# EAGLE design AVR_ISP_Pegelwandler (EAGLE 9.2.2)
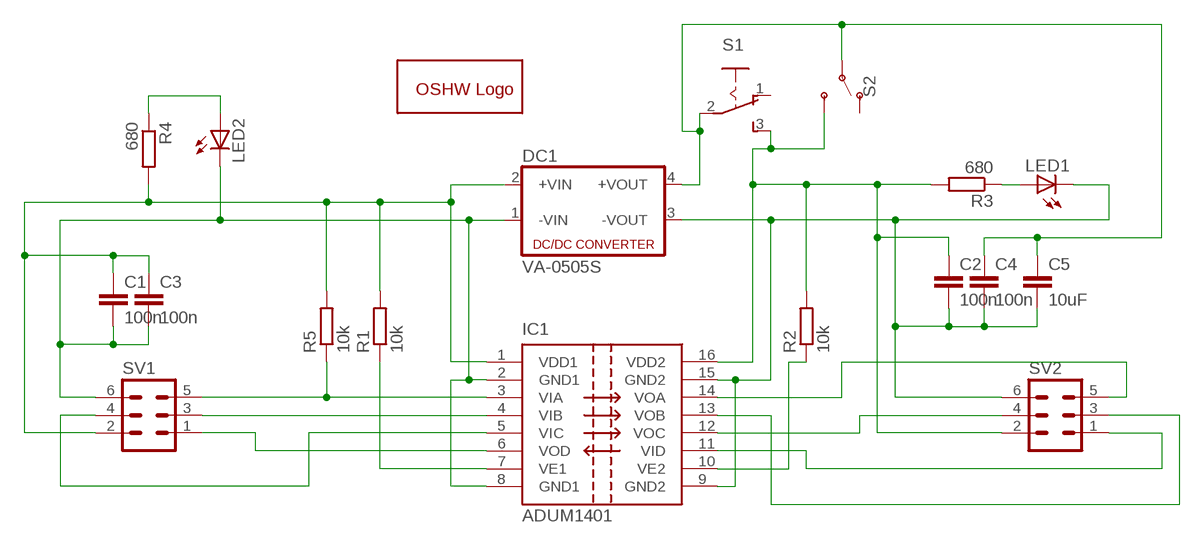
[diagram p0: schematic, sheet 1]

## Parts
C1  100n  C-EUC1206  [C1206]
C2  100n  C-EUC1206  [C1206]
C3  100n  C-EUC1206  [C1206]
C4  100n  C-EUC1206  [C1206]
C5  10uF  C-EUC1206  [C1206]
DC1  VA-0505S  [4SIL]
GOLD_ORB_SM1  OSHWLOGOLOGO5MM  [OSHW_5MM]
IC1  ADUM1401  [SO16W]
LED1  LEDCHIPLED_1206  [CHIPLED_1206]
LED2  LEDCHIPLED_1206  [CHIPLED_1206]
R1  10k  R-EU_R1206  [R1206]
R2  10k  R-EU_R1206  [R1206]
R3  680  R-EU_R1206  [R1206]
R4  680  R-EU_R1206  [R1206]
R5  10k  R-EU_R1206  [R1206]
S1  255SB  [255SB]
S2  SWITCH-SPDT-PTH-11.6X4.0MM  [SWITCH_SPDT_PTH_11.6X4.0MM]
SV1  ML6  [ML6]
SV2  ML6  [ML6]

## Nets
GND1@2: C1.2 C3.2 DC1.1(-VIN) IC1.2(GND1) IC1.8(GND1) LED2.C SV1.6
GND2@2: C2.2 C4.2 C5.2 DC1.3(-VOUT) IC1.9(GND2) IC1.15(GND2) LED1.C SV2.6
N$1: C1.1 C3.1 DC1.2(+VIN) IC1.1(VDD1) R1.2 R4.2 R5.2 SV1.2
N$2: C2.1 IC1.16(VDD2) R2.2 R3.2 S1.3(S) S2.3(S) SV2.2
N$3: LED1.A R3.1
N$4: IC1.4(VIB) SV1.3
N$5: IC1.13(VOB) SV2.3
N$6: IC1.14(VOA) SV2.5
N$7: IC1.11(VID) SV2.1
N$8: IC1.6(VOD) SV1.1
N$9: IC1.12(VOC) SV2.4
N$10: IC1.5(VIC) SV1.4
N$11: IC1.3(VIA) R5.1 SV1.5
N$12: IC1.7(VE1) R1.1
N$13: IC1.10(VE2) R2.1
N$14: C4.1 C5.1 DC1.4(+VOUT) S1.2(P) S2.2(P)
N$15: LED2.A R4.1
Unconnected: S1.1(O) S2.1(O)

## Library data of the parts
C1-C5 = resistor:C-EU: CAPACITOR, European symbol
DC1 = dc-dc-converter:VA-*?: DC DC Converter Single Output, 1 Watt Motien Technology Co.,Ltd. Source: va-serie.pdf
GOLD_ORB_SM1 = oshw:OSHWLOGO: The OSHW logo for PCB layout
IC1 = adum140x:ADUM1401
LED1 LED2 = led:LED: LED OSRAM: - CHIPLED LG R971, LG N971, LY N971, LG Q971, LY Q971, LO R971, LY R971 LH N974, LH R974 LS Q976, LO Q976, LY Q976 LO Q996 - Hyper CHIPLED LW Q18S LB Q993, LB Q99A, LB R99A - SideLED LS A670, LO A670, LY A670, LG A670, LP A670 LB A673, LV A673, LT A673, LW A673 LH A674 LY A675 LS A676, LA A676, LO A676, LY A676, LW A676 LS A679, LY A679, LG A679 - Hyper Micro SIDELED® LS Y876, LA Y876, LO Y876, LY Y876 LT Y87S - SmartLED LW L88C, LW L88S LB L89C, LB L89S, LG L890 LS L89K, LO L89K, LY L89K LS L896, LA L896, LO L896, LY L896 - TOPLED LS T670, LO T670, LY T670, LG T670, LP T670 LSG T670, LSP T670, LSY T670, LOP T670, LYG T670 LG T671, LOG T671, LSG T671 LB T673, LV T673, LT T673, LW T673 LH T674 LS T676, LA T676, LO T676, LY T676, LB T676, LH T676, LSB T676, LW T676 LB T67C, LV T67C, LT T67C, LS T67K, LO T67K, LY T67K, LW E67C LS E67B, LA E67B, LO E67B, LY E67B, LB E67C, LV E67C, LT E67C LW T67C LS T679, LY T679, LG T679 LS T770, LO T770, LY T770, LG T770, LP T770 LB T773, LV T773, LT T773, LW T773 LH T774 LS E675, LA E675, LY E675, LS T675 LS T776, LA T776, LO T776, LY T776, LB T776 LHGB T686 LT T68C, LB T68C - Hyper Mini TOPLED® LB M676 - Mini TOPLED Santana® LG M470 LS M47K, LO M47K, LY M47K Source: http://www.osram.convergy.de LUXEON: - LUMILED® LXK2-PW12-R00, LXK2-PW12-S00, LXK2-PW14-U00, LXK2-PW14-V00 LXK2-PM12-R00, LXK2-PM12-S00, LXK2-PM14-U00 LXK2-PE12-Q00, LXK2-PE12-R00, LXK2-PE12-S00, LXK2-PE14-T00, LXK2-PE14-U00 LXK2-PB12-K00, LXK2-PB12-L00, LXK2-PB12-M00, LXK2-PB14-N00, LXK2-PB14-P00, LXK2-PB14-Q00 LXK2-PR12-L00, LXK2-PR12-M00, LXK2-PR14-Q00, LXK2-PR14-R00 LXK2-PD12-Q00, LXK2-PD12-R00, LXK2-PD12-S00 LXK2-PH12-R00, LXK2-PH12-S00 LXK2-PL12-P00, LXK2-PL12-Q00, LXK2-PL12-R00 Source: www.luxeon.com KINGBRIGHT: KA-3528ASYC Source: www.kingbright.com
R1-R5 = resistor:R-EU_: RESISTOR, European symbol
S1 = switch:255SB: SLIDING SWITCH Distributor Buerklin, 11G810
S2 = SparkFun-Switches:SWITCH-SPDT: Single Pole, Double Throw (SPDT) Switch Single-pole, double-throw (SPDT) switch. Variant Overview SMD-AYZ0202 Surface Mount DPDT Switch <https://www.sparkfun.com/products/597> (COM-00597) Used on e.g. LilyPad Arduino USB - ATmega32U4 Board <https://www.sparkfun.com/products/12049> PTH-11.6X4.0MM SPDT Mini Power Switch <https://www.sparkfun.com/products/102> (COM-00102) Used on e.g. SparkFun Simon Says - Through-Hole Soldering Kit <https://www.sparkfun.com/products/10547> (KIT-10547) PTH-11.6X4.0MM-KIT KIT version of SPDT Mini Power Switch - Simplifies soldering by removing tStop of switch pins - only one side can be soldered. PTH-11.6X4.0MM-LOCK LOCK version of SPDT Mini Power Switch - Offset pins hold switch in place for easier soldering. SMD-RIGHT-ANGLE Surface Mount Right Angle Switch <https://www.sparkfun.com/products/10860> (COM-10860) Used on e.g. SparkFun ESP8266 Thing <https://www.sparkfun.com/products/13231>; PROD_ID: SWCH-08261; SF_SKU: COM-00102
SV1 SV2 = con-harting-ml:ML6: HARTING; OC_FARNELL: unknown; OC_NEWARK: unknown

## Board
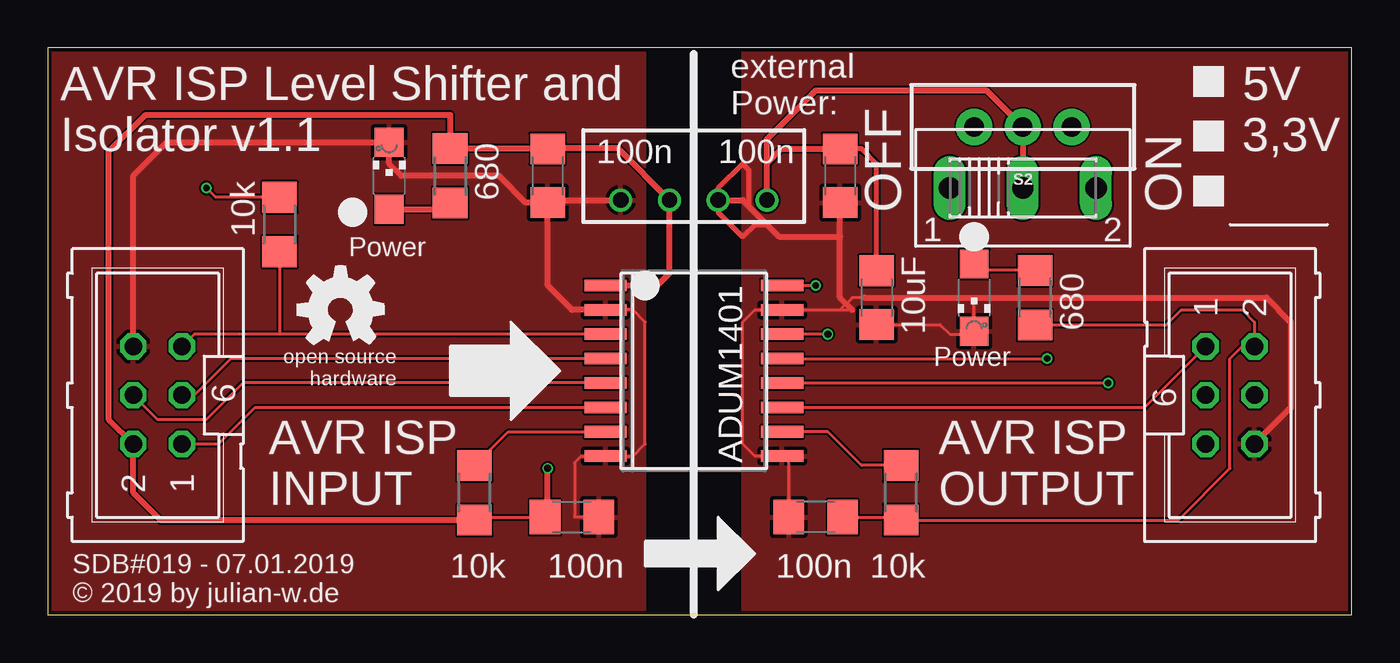
[diagram p1: board, top side]
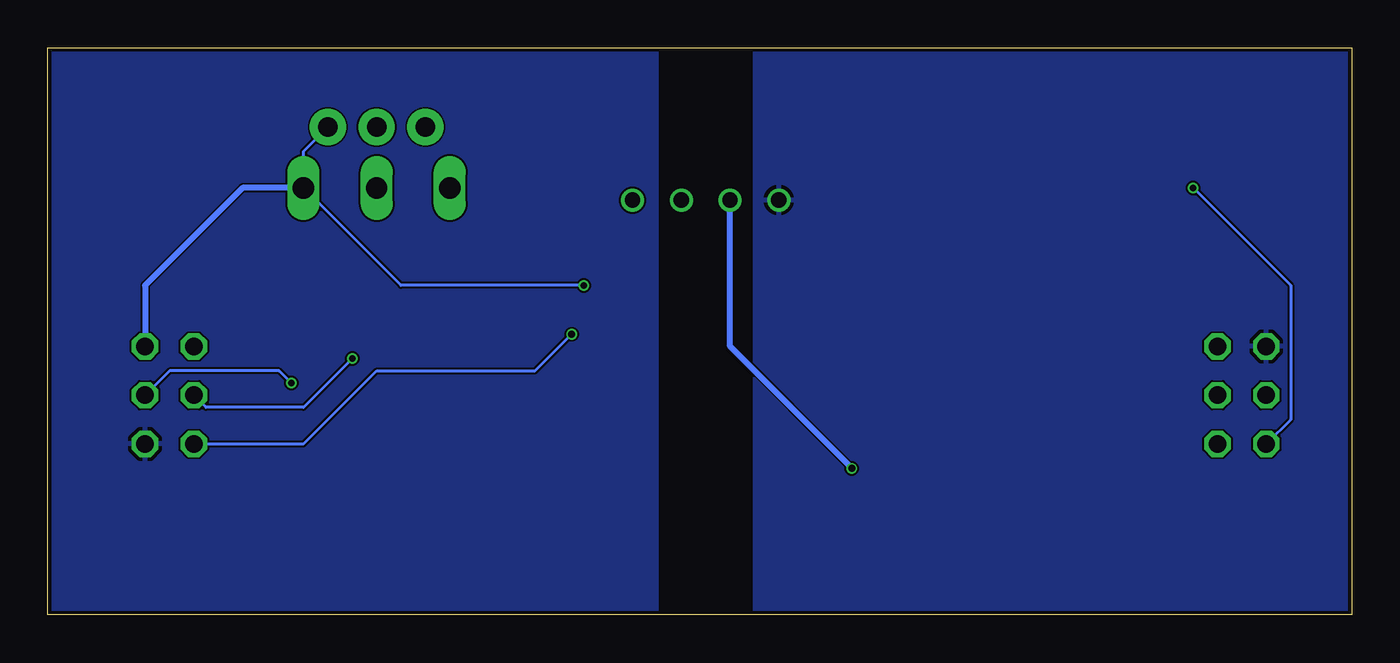
[diagram p2: board, bottom side, seen from below]

Size 67.92 x 29.52 mm. Coordinates in mm from the lower left corner, seen from the top.
Outline: 0,0 67.92,0 67.92,29.52 0,29.52 0,0
Copper layers (1*16): Top 0.018mm / dielectric 1.55mm / Bottom 0.018mm
Design rules "Multi-CB_2L_100µm-Tracks_OL35µm": minimum track width 0.1mm, minimum drill 0.2mm, track to track 0.1mm, track to pad 0.1mm, pad to pad 0.1mm, via to via 0.1mm, smd to smd 0mil, copper to edge 0.2mm, drill to drill 0.2mm, minimum pad ring 0.125mm, minimum via ring 0.1mm, stop-mask expansion 2mil, vias tented up to drill 0.45mm, thermal gap 0.2mm

### Footprints (pad centres in the part's own frame; a part is rotated, then mirrored left to right if it is on the bottom)
C1206 = smd 1.6 x 1.8: 1 -1.4,0; 2 1.4,0
4SIL = drill 0.8: 1 -3.81,0; 2 -1.27,0; 3 1.27,0; 4 3.81,0
SO16W = smd 0.6 x 2.2: 1 -4.445,-4.6; 2 -3.175,-4.6; 3 -1.905,-4.6; 4 -0.635,-4.6; 5 0.635,-4.6; 6 1.905,-4.6; 7 3.175,-4.6; 8 4.445,-4.6; 9 4.445,4.6; 10 3.175,4.6; 11 1.905,4.6; 12 0.635,4.6; 13 -0.635,4.6; 14 -1.905,4.6; 15 -3.175,4.6; 16 -4.445,4.6
CHIPLED_1206 = smd 1.5 x 1.5: A 0,-1.75; C 0,1.75
R1206 = smd 1.6 x 1.803: 1 -1.422,0; 2 1.422,0
255SB = drill 1.118 long: 1 -3.81,0; 2 0,0; 3 3.81,0
SWITCH_SPDT_PTH_11.6X4.0MM = drill 1.016 pad 1.88: 1 0,2.54; 2 0,0; 3 0,-2.54
ML6 = drill 0.914 octagon: 1 -2.54,-1.27; 2 -2.54,1.27; 3 0,-1.27; 4 0,1.27; 5 2.54,-1.27; 6 2.54,1.27

### Placement (x,y rotation side)
C1  27.3,5.08 0 top
C2  40.01,5.08 180 top
C3  26.04,22.86 270 top
C4  41.27,22.86 270 top
C5  43.18,16.51 270 top
DC1  33.66,21.59 0 top
GOLD_ORB_SM1  15.24,15.88 0 top
IC1  33.66,12.7 270 top
LED1  48.26,16.51 180 top
LED2  17.78,22.86 0 top
R1  22.23,6.35 270 top
R2  44.45,6.35 270 top
R3  51.44,16.51 270 top
R4  20.95,22.86 90 top
R5  12.06,20.32 90 top
S1  50.8,22.23 0 top
S2  50.8,25.4 90 top
SV1  5.71,11.43 90 top
SV2  61.59,11.43 270 top

### Tracks (layer width: path | path; a pad name or v marks a point on that pad's centre or on a via)
GND1@2
  Top 0.152: C1.2 27.43,5.08 27.43,7.91 27.79,8.26 IC1.8 30.48,8.26 31.11,8.89 31.11,15.24 30.48,15.88 28.57,15.88
  Top 0.305: SV1.6 4.45,22.86 6.2,24.61 LED2.C 17.78,23.5 18.41,22.86 23.5,22.86 24.89,21.46 C3.2 | C3.2 26.16,21.59 DC1.1 | IC1.2 28.57,15.88 27.3,15.88 26.04,17.14 C3.2
  pour Top: -1.27,-0.64 0,-1.91 31.11,-1.91 31.11,29.84 -0.64,29.84 -0.64,0
  pour Bottom: -1.27,-0.64 0,-1.91 31.11,-1.91 31.11,29.84 -0.64,29.84 -0.64,0
GND2@2
  Top 0.152: C2.2 38.6,7.91 IC1.9 36.83,8.26 36.2,8.89 36.2,15.24 36.83,15.88 IC1.15 41.27,15.88 | 63.5,16.51 48.26,16.51 | 48.26,16.51 42.55,16.51 41.91,16.51 41.27,15.88 | 41.27,15.88 41.91,15.88 | 48.26,16.51 LED1.C 48.1,14.61 46.99,14.61 46.48,15.11 C5.2 | 41.27,20.95 C4.2
  Top 0.254: 36.51,21.27 36.51,23.18 36.2,23.5 34.92,22.23 DC1.3 34.92,20.95 36.2,19.68 36.83,20.32 37.47,20.32
  Top 0.305: DC1.3 36.2,21.59 36.51,21.27 37.47,20.32 38.1,19.68 41.27,19.68 | 41.27,19.68 41.27,20.95 | 41.27,19.68 41.27,16.51 41.91,15.88 | 42.55,16.51 63.5,16.51 64.77,15.24 64.77,10.79 SV2.6
  pour Top: 69.85,-1.27 69.85,31.75 36.2,31.75 36.2,-1.91 69.22,-1.91
  pour Bottom: 69.85,-1.27 69.85,31.75 36.2,31.75 36.2,-1.91 69.22,-1.91
N$1  (via drill 0.35)
  Top 0.152: R1.2 22.38,5.08 C1.1 | R5.2 8.74,21.74 v8.26,22.23
  Top 0.305: 26.01,24.28 R4.2 20.95,26.04 5.08,26.04 3.17,24.13 3.17,10.16 SV1.2 4.45,6.35 5.87,4.93 R1.2 | 26.01,24.28 C3.1 | 26.01,24.28 29.69,24.28 DC1.2 32.38,17.78 31.75,17.14 IC1.1 | C1.1 26.04,5.21 v26.04,7.62
  Bottom 0.152: v8.26,22.23 3.17,17.14 3.17,10.16 SV1.2
  Bottom 0.305: v26.04,7.62 32.38,13.97 DC1.2
N$2  (via drill 0.35)
  Top 0.152: C2.1 44.3,5.08 R2.2 58.9,4.93 61.59,7.62 61.59,13.34 62.23,13.97 SV2.2 62.87,15.24 62.23,15.88 59.05,15.88 58.27,15.09 R3.2 | IC1.16 v40.01,17.14
  Bottom 0.152: v40.01,17.14 49.53,17.14 S1.3 54.61,24.13 S2.3
  Bottom 0.305: S1.3 57.78,22.23 62.87,17.14 SV2.2
N$3
  Top 0.152: R3.1 48.59,17.93 LED1.A | LED1.A | LED1.A
N$4
  Top 0.152: IC1.4 9.53,13.34 7.62,11.43 SV1.3
N$5  (via drill 0.35)
  Top 0.152: IC1.13 v52.07,13.34
  Bottom 0.152: v52.07,13.34 54.61,10.79 59.69,10.79 SV2.3
N$6  (via drill 0.35)
  Top 0.152: v40.64,14.61 IC1.14
  Bottom 0.152: SV2.5 54.61,8.89 50.8,12.7 42.55,12.7 v40.64,14.61
N$7
  Top 0.152: IC1.11 57.15,10.79 SV2.1
N$8
  Top 0.152: SV1.1 8.89,8.89 10.79,10.79 IC1.6
N$9  (via drill 0.35)
  Top 0.152: IC1.12 v55.24,12.06
  Bottom 0.152: v55.24,12.06 55.88,12.7 61.59,12.7 SV2.4
N$10
  Top 0.152: SV1.4 5.71,10.16 8.26,10.16 10.16,12.06 IC1.5
N$11
  Top 0.152: IC1.3 12.06,14.61 | 12.06,14.61 7.62,14.61 SV1.5 | R5.1 12.06,14.61
N$12
  Top 0.152: R1.1 23.98,9.53 IC1.7
N$13
  Top 0.152: R2.1 42.39,7.77 40.64,9.53 IC1.10
N$14
  Top 0.254: C5.1 43.18,23.5 42.41,24.26 C4.1
  Top 0.305: C4.1 38.23,24.26 37.47,23.5 DC1.4 37.47,24.77 40.01,27.3 48.9,27.3 S2.2 S1.2
N$15
  Top 0.254: R4.1 20.63,21.11
  Top 0.305: LED2.A 20.63,21.11 R4.1

### Text on the board
tNames: external / Power: | AVR ISP Level Shifter and / Isolator v1.1 | 5V / 3,3V | OFF | ON | Power | Power | AVR ISP / INPUT | AVR ISP / OUTPUT | SDB#019 - 07.01.2019 / © 2019 by julian-w.de